# Altium schematic sheet Э3.SchDoc: Плата фильтра
size 420 x 297 mm; PageSetup: Record=PageOptions|CenterHorizontal=True|CenterVertical=True|PrintScale=1.00|XCorrection=1.00|YCorrection=1.00|PrintKind=1|BorderSize=5000000|LeftOffset=0|BottomOffset=0|Orientation=2|PaperLength=1000|PaperWidth=1000|Scale=100|PaperSource=15|PrintQuality=1200|MediaType=1|DitherType=10|PaperKind=A3|PrintScaleMode=1; Weight: -; ScaleFactor: -; CheckedBy: Бойков; Author: Тарасов; CompanyName: РРБО-01-24; Address1: Address1; Address2: Address2; Address3: Address3; Address4: Address4; DocumentNumber: МРАГ.43 1122.100 Э3; SheetNumber: 1; SheetTotal: 1; DocumentType: Схема электрическая принципиальная; FirstReferrence: МРАГ.43 1122.100 Э3
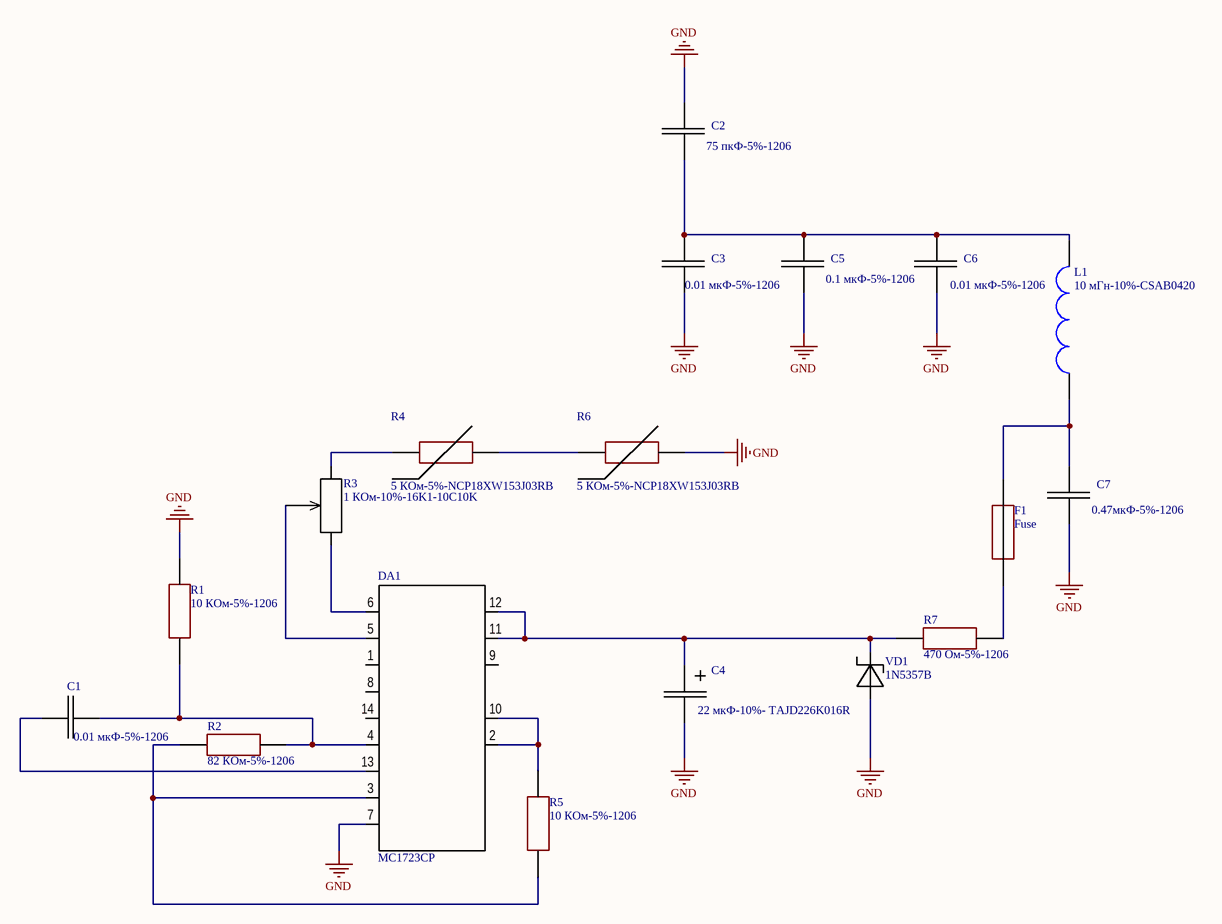
[diagram p0: Э3.SchDoc]

## Parts
C1  0.01 мкФ-5%-1206  [1206_cond]
C2  75 пкФ-5%-1206  [1206_cond]
C3  0.01 мкФ-5%-1206  [1206_cond]
C4  22 мкФ-10%- TAJD226K016R  [TAJD]
C5  0.1 мкФ-5%-1206  [1206_cond]
C6  0.01 мкФ-5%-1206  [1206_cond]
C7  0.47мкФ-5%-1206  [1206_cond]
DA1  MC1723CP  [SOIC-14]
F1  Fuse  [F1]
L1  10 мГн-10%-CSAB0420  [Ind]
R1  10 КОм-5%-1206  [1206]
R2  82 КОм-5%-1206  [1206]
R3  1 КОм-10%-16K1-10C10K  [16K1]
R4  5 КОм-5%-NCP18XW153J03RB  [Term]
R5  10 КОм-5%-1206  [1206]
R6  5 КОм-5%-NCP18XW153J03RB  [Term]
R7  470 Ом-5%-1206  [1206]
VD1  1N5357B  [Stab]

## Nets
GND: C2.1 C3.0 C4.1 C5.0 C6.0 C7.0 DA1.7 R1.1 R6.1 VD1.0
NetC1_0: C1.0 DA1.13
NetC1_1: C1.1 DA1.4 R1.0 R2.1
NetC2_0: C2.0 C3.1 C5.1 C6.1 L1.1
NetC4_0: C4.0 DA1.11 DA1.12 R7.0 VD1.1
NetC7_1: C7.1 F1.1 L1.0
NetDA1_2: DA1.2 DA1.10 R5.1
NetDA1_3: DA1.3 R2.0 R5.0
NetDA1_5: DA1.5 R3.3
NetDA1_6: DA1.6 R3.1
NetF1_0: F1.0 R7.1
NetR3_2: R3.2 R4.0
NetR4_1: R4.1 R6.0

Not connected (* = marked no-connect by the designer): DA1 1 8 9 14

## Notes on the sheet
- Перв. примен.
- Справ. №
- Подп. и дата
- Инв. № дубл.
- Взам. инв. №
- Разраб.
- Изм.
- Лист
- № докум.
- Подп.
- Дата
- Лит.
- Масса
- Масштаб
- Пров.
- Т.контр.
- Листов
- Инв. № подл.
- Утв.
- Н.контр.
- 2.106-A3
- Копировал
- Формат А3

## Library data of the parts
C1-C3 C5-C7 = Cap_1206C
C4 = Cap_pol
F1 = F1
L1 = Inductor_0603L
R1 R2 R5 R7 = Resistor 1206R
R3 = Resistor_per
R4 R6 = Term
VD1 = Stab